# Altium schematic sheet LCD_ULTRA.SchDoc
size Letter; SheetNumber: 8; SheetTotal: 11
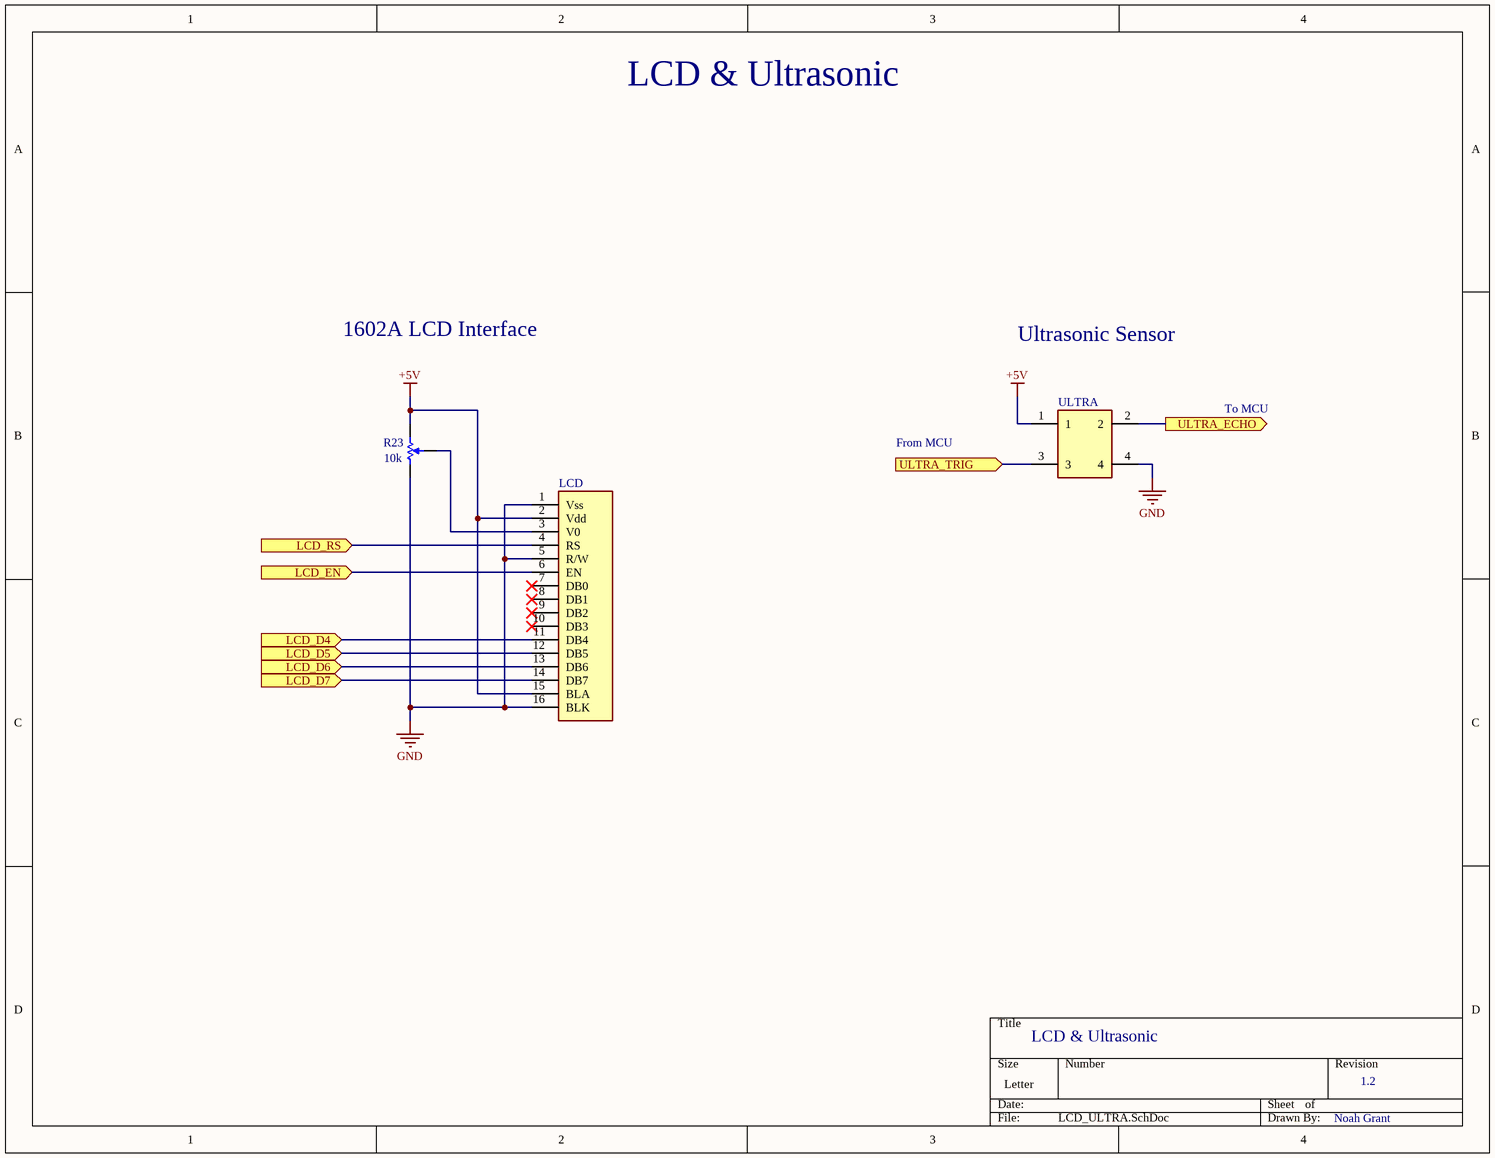
[diagram p0: LCD_ULTRA.SchDoc]

## Parts
LCD  PPPC161LFBN-RC  [RHDR16W80P0X254_1X16_4114X254X850P]  (value not drawn)
R23  10k  [BOUR-TC33X-2_V]
ULTRA  22-28-4043  [HDRV4W87P0X254_1X4_1016X249X863P]  (value not drawn)

## Ports
LCD_D4 (in, see Top_Sheet[4C], Nucleo[3C]), LCD_D5 (in, see Top_Sheet[4C], Nucleo[3C]), LCD_D6 (in, see Top_Sheet[4C], Nucleo[3C]), LCD_D7 (in, see Top_Sheet[4C], Nucleo[4C]), LCD_EN (in, see Top_Sheet[4C], Nucleo[3C]), LCD_RS (in, see Top_Sheet[4C], Nucleo[3C]), ULTRA_ECHO (out, see Top_Sheet[4C], Nucleo[3C]), ULTRA_TRIG (in, see Top_Sheet[4C], Nucleo[4C])

## Nets
+5V: LCD.2(Vdd) LCD.15(BLA) R23.3 ULTRA.1
GND: LCD.1(Vss) LCD.5(R/W) LCD.16(BLK) R23.1 ULTRA.4
LCD_D4: LCD.11(DB4) ; port LCD_D4
LCD_D5: LCD.12(DB5) ; port LCD_D5
LCD_D6: LCD.13(DB6) ; port LCD_D6
LCD_D7: LCD.14(DB7) ; port LCD_D7
LCD_EN: LCD.6(EN) ; port LCD_EN
LCD_RS: LCD.4(RS) ; port LCD_RS
ULTRA_ECHO: ULTRA.2 ; port ULTRA_ECHO
ULTRA_TRIG: ULTRA.3 ; port ULTRA_TRIG
NetLCD_3: LCD.3(V0) R23.2

Not connected (* = marked no-connect by the designer): LCD 7(DB0)* 8(DB1)* 9(DB2)* 10(DB3)*

## Notes on the sheet
- LCD & Ultrasonic
- 1602A LCD Interface
- Ultrasonic Sensor
- To MCU
- From MCU
- 1.2
- Noah Grant

## Library data of the parts
LCD = PPPC161LFBN-RC: Connector; Manufacturer_Name: Sullins; Datasheet Link: https://drawings-pdf.s3.amazonaws.com/10492.pdf; Height: 8.5mm; Manufacturer_Part_Number: PPPC161LFBN-RC
R23 = CMP-2100-03695-1: Trimming Potentiometer, 10000 Ohm, -40 to 100 degC, 3-Pin SMD, RoHS, Tape and Reel; Manufacturer: Bourns; Tolerance: 25%; Max Power Dissipation: 100mW; Number of Turns: 1; Resistance: 10KOhm; Temperature Coefficient: 250ppm/degreesC; Voltage Rating (DC): 50V; Datasheet URL: http://www.bourns.com/docs/Product-Datasheets/TC33.pdf; Composition: Potentiometer; Package Description: 3-Pin Surface Mount Device, Body 3.8 x 3.6 mm; Weight: 29.4mg; Power Rating: 100mW; Termination: FootPrint; Manufacturer URL: http://www.bourns.com/; Width: 0.118inch; Height: 0.047inch; Military Standard: Not; Radiation Hardening: No; Colour: Silver; Case/Package: SMD/SMT; Depth: 3.8mm; Min Operating Temperature: -40degC; Lead Free: LeadFree; Datasheet Version: 42583.0; REACH SVHC: NoSVHC; Length: 3mm; RoHSCompliant: true; Contact Plating: Silver; Taper: Linear; Packaging: TapeandReel; Mount: SurfaceMount; Max Operating Temperature: 100degC; Package Reference: TC33X-2; Package Quantity: 2500
ULTRA = 22-28-4043: Connector; Manufacturer_Name: Molex; Datasheet Link: http://www.molex.com/molex/products/datasheet.jsp?part=active/0022284023_PCB_HEADERS.xml; Height: 8.63mm; Manufacturer_Part_Number: 22-28-4043; Mouser Part Number: 538-22-28-4043; Mouser Price/Stock: https://www.mouser.co.uk/ProductDetail/Molex/22-28-4043?qs=MuwpYaHj751%252Bm8qLwZDsXA%3D%3D